# Altium schematic sheet connector.SchDoc
size A; SheetNumber: 5; SheetTotal: 6
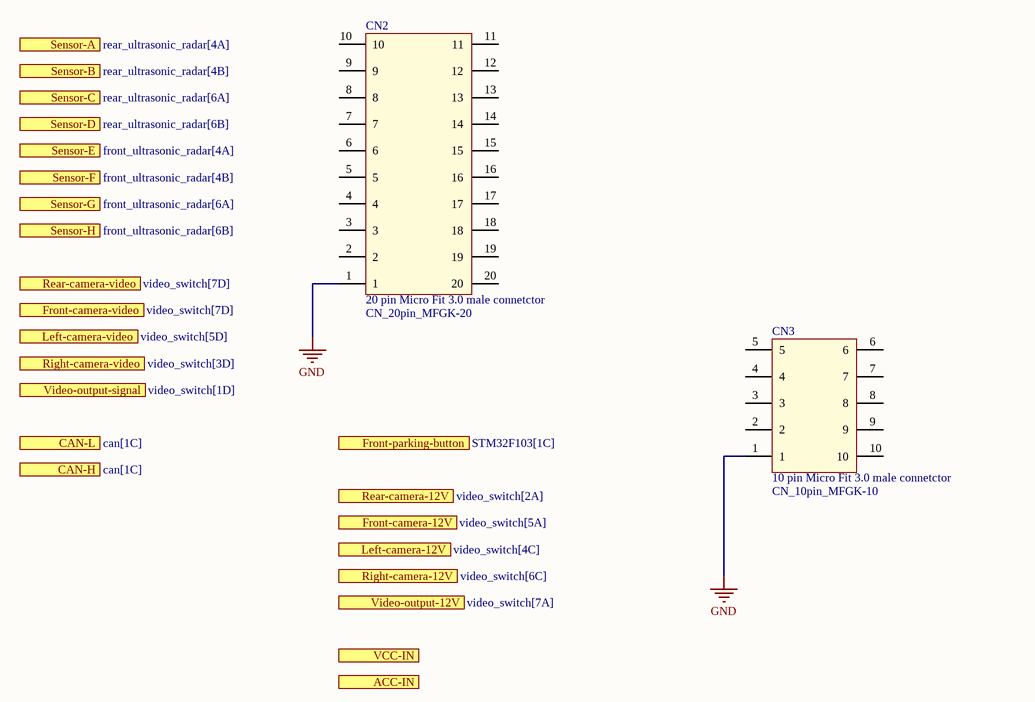
[diagram p0: connector.SchDoc]

## Parts
CN2  20 pin Micro Fit 3.0 male connetctor  [CN_20pin_MFGK-20]
CN3  10 pin Micro Fit 3.0 male connetctor  [CN_10pin_MFGK-10]

## Ports
ACC-IN, CAN-H (see can[1C]), CAN-L (see can[1C]), Front-camera-12V (see video_switch[5A]), Front-camera-video (see video_switch[7D]), Front-parking-button (see STM32F103[1C]), Left-camera-12V (see video_switch[4C]), Left-camera-video (see video_switch[5D]), Rear-camera-12V (see video_switch[2A]), Rear-camera-video (see video_switch[7D]), Right-camera-12V (see video_switch[6C]), Right-camera-video (see video_switch[3D]), Sensor-A (see rear_ultrasonic_radar[4A]), Sensor-B (see rear_ultrasonic_radar[4B]), Sensor-C (see rear_ultrasonic_radar[6A]), Sensor-D (see rear_ultrasonic_radar[6B]), Sensor-E (see front_ultrasonic_radar[4A]), Sensor-F (see front_ultrasonic_radar[4B]), Sensor-G (see front_ultrasonic_radar[6A]), Sensor-H (see front_ultrasonic_radar[6B]), VCC-IN, Video-output-12V (see video_switch[7A]), Video-output-signal (see video_switch[1D])

## Nets
GND: CN2.1 CN3.1

Not connected (* = marked no-connect by the designer): CN2 2 3 4 5 6 7 8 9 10 11 12 13 14 15 16 17 18 19 20; CN3 2 3 4 5 6 7 8 9 10

## Library data of the parts
CN2 = 02_10136: Molex, Micro-Fit 3.0, 43045, 20 Way, 2 Row, Right Angle PCB Header; Manufacturer PN: 43045-2000; AutoId: 177; Value2: 20 pin; Value3: 3.0 mm; DeviceType: Connector_; Id: 02_10136; Value1: CN_20pin_MFGK-20; Manufacturer: Molex; MountType: SMT; ComponentLink1Description: Datasheet; ComponentLink1URL: X:\01_Datasheets\CN_molex_micro_fit_430045.pdf; ComponentLink2Description: ComponentVerificationSheet; ComponentLink2URL: X:\02_ComponentVerificationSheets\; Supplier 1: kosmodrom.ua; Supplier Part Number 1: 00-00041123
CN3 = 02_10137: Molex, Micro-Fit 3.0, 43045, 10 Way, 2 Row, Right Angle PCB Header; Manufacturer PN: 43045-1000; AutoId: 179; Value2: 10 pin; Value3: 3.0 mm; DeviceType: Connector_; Id: 02_10137; Value1: CN_10pin_MFGK-10; Manufacturer: Molex; MountType: SMT; ComponentLink1Description: Datasheet; ComponentLink1URL: X:\01_Datasheets\CN_molex_micro_fit_430045.pdf; ComponentLink2Description: ComponentVerificationSheet; ComponentLink2URL: X:\02_ComponentVerificationSheets\; Supplier 1: kosmodrom.ua; Supplier Part Number 1: 00-00041120